# Altium schematic sheet WIFI_NVME.SchDoc
size C; SheetNumber: 7; SheetTotal: 24
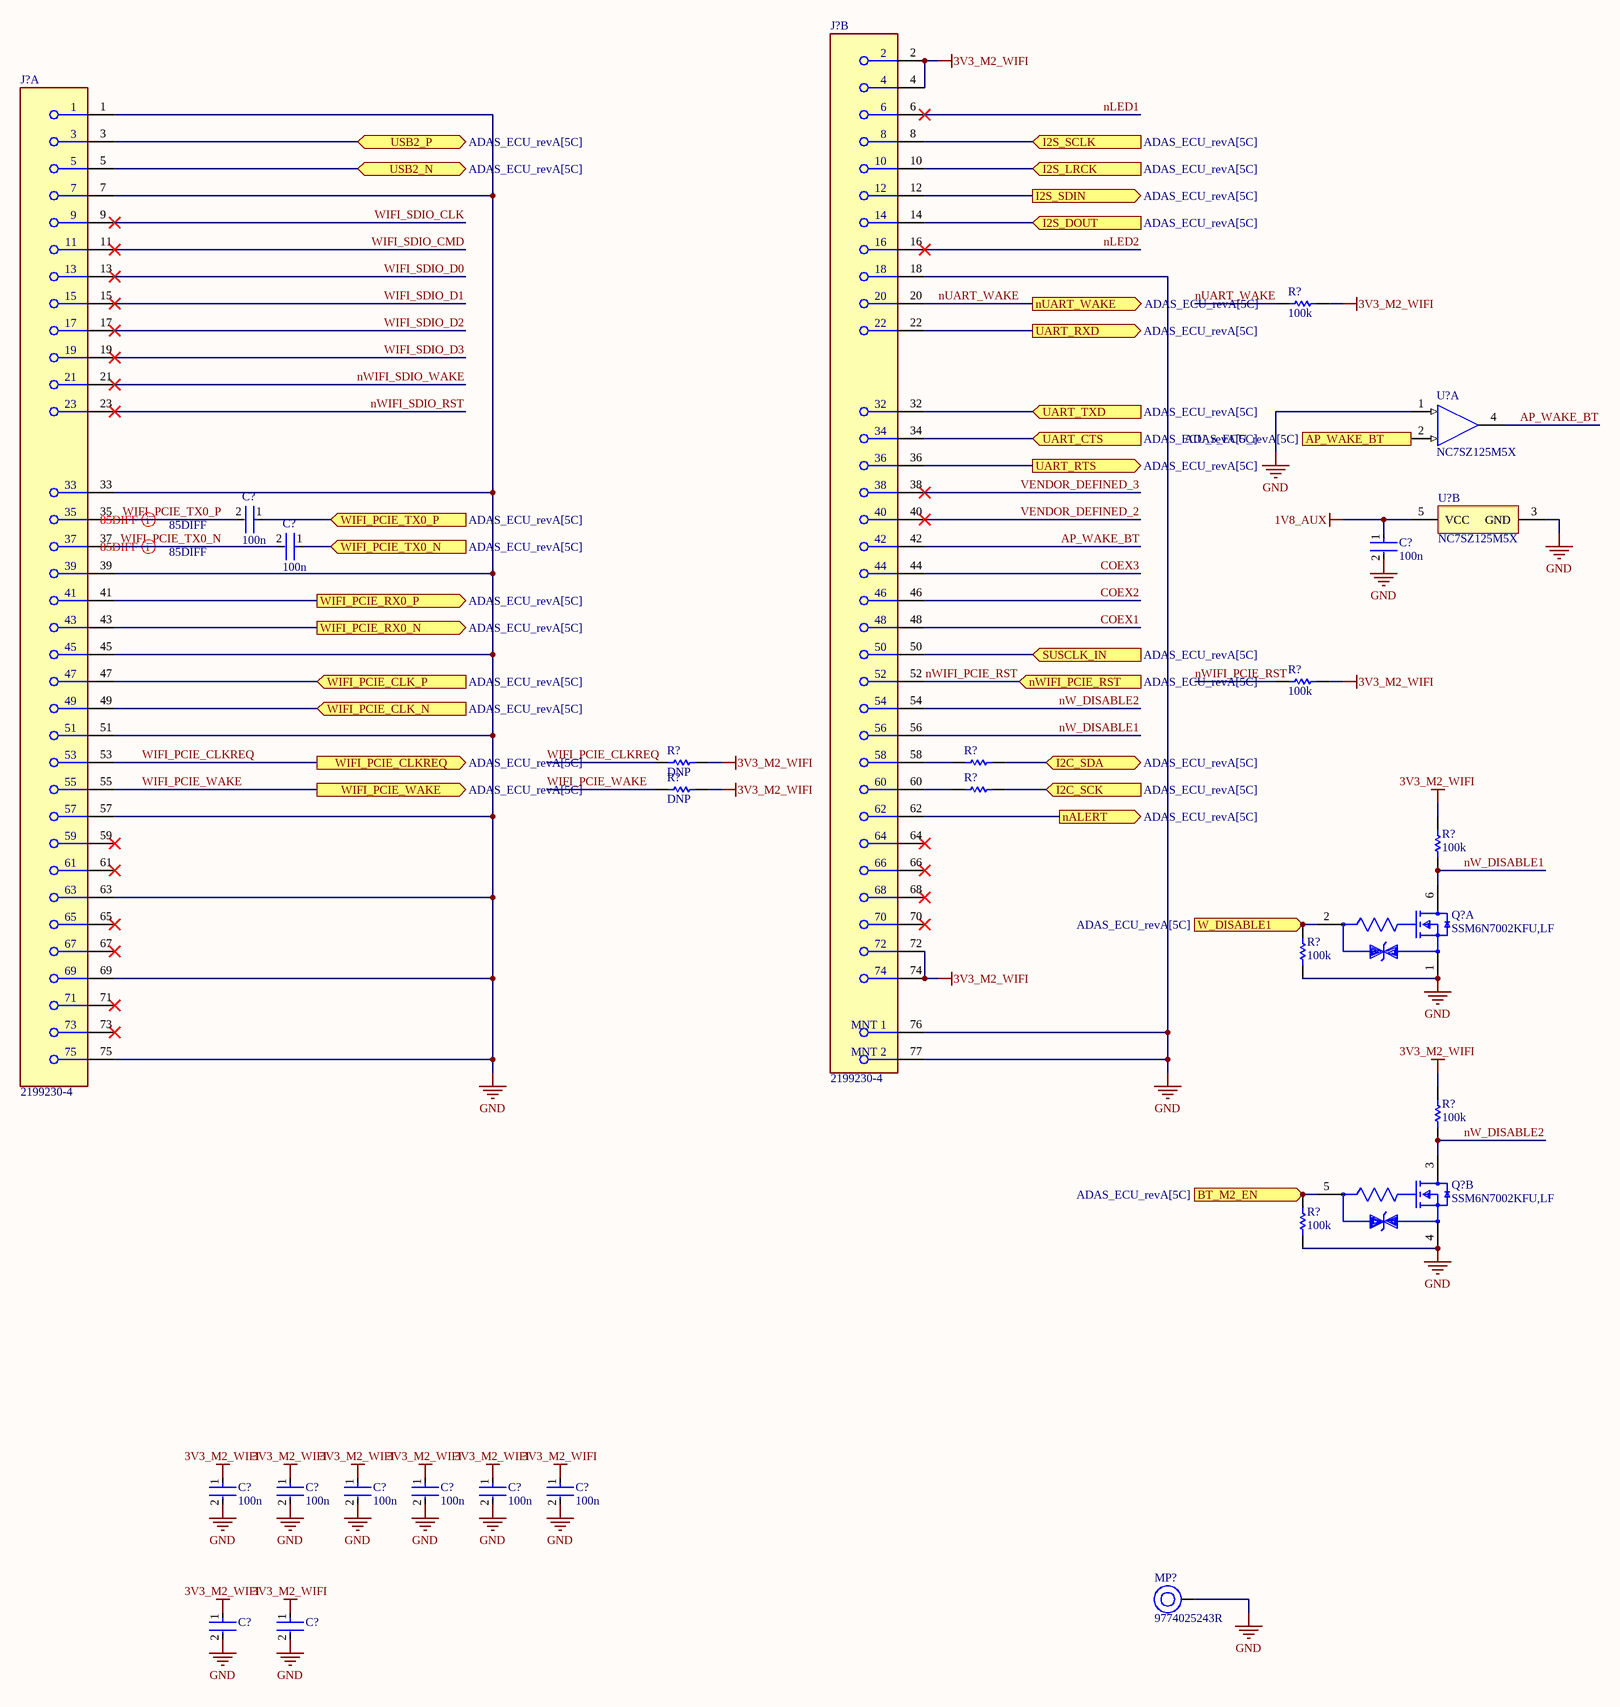
[diagram p0: WIFI_NVME.SchDoc]

## Parts
(Parts that share a designator on the sheet are numbered #1, #2 ... from top to bottom, then left to right.)
C?#1  100n  [FP-0402-L_1_0_0_05-W_0_5-IPC_A]
C?#2  100n  [FP-0402-L_1_0_0_05-W_0_5-IPC_A]
C?#3  100n  [FP-0402-L_1_0_0_05-W_0_5-IPC_A]
C?#4  100n  [FP-0402-L_1_0_0_05-W_0_5-IPC_A]
C?#5  100n  [FP-0402-L_1_0_0_05-W_0_5-IPC_A]
C?#6  100n  [FP-0402-L_1_0_0_05-W_0_5-IPC_A]
C?#7  100n  [FP-0402-L_1_0_0_05-W_0_5-IPC_A]
C?#8  100n  [FP-0402-L_1_0_0_05-W_0_5-IPC_A]
C?#9  100n  [FP-0402-L_1_0_0_05-W_0_5-IPC_A]
C?#10  GRM188R60J106ME47D  [FP-GRM188-0_1-e0_2_0_55-IPC_A]  (value not drawn)
C?#11  GRM188R60J106ME47D  [FP-GRM188-0_1-e0_2_0_55-IPC_A]  (value not drawn)
J?#1  2199230-4  [FP-2199230-4-MFG]  (part B of 2)
J?#2  2199230-4  [FP-2199230-4-MFG]  (part A of 2)
MP?  9774025243R  [9774025243]
Q?#1  SSM6N7002KFU,LF  [FP-SSOP6-P-0_65A-MFG]  (part A of 2)
Q?#2  SSM6N7002KFU,LF  [FP-SSOP6-P-0_65A-MFG]  (part B of 2)
R?#1  100k  [R0603B]
R?#2  100k  [R0603B]
R?#3  DNP  [RESC1005X40X25ML05T05]  (value not drawn)
R?#4  DNP  [R0603B]
R?#5  DNP  [RESC1005X40X25ML05T05]  (value not drawn)
R?#6  DNP  [R0603B]
R?#7  100k  [R0603B]
R?#8  100k  [R0603B]
R?#9  100k  [R0603B]
R?#10  100k  [R0603B]
U?#1  NC7SZ125M5X  [FAIR-SOT23-5_V]  (part A of 2)
U?#2  NC7SZ125M5X  [FAIR-SOT23-5_V]  (part B of 2)

## Ports
AP_WAKE_BT (in, see ADAS_ECU_revA[5C]), BT_M2_EN (in, see ADAS_ECU_revA[5C]), I2C_SCK (in, see ADAS_ECU_revA[5C]), I2C_SDA (bidir, see ADAS_ECU_revA[5C]), I2S_DOUT (in, see ADAS_ECU_revA[5C]), I2S_LRCK (in, see ADAS_ECU_revA[5C]), I2S_SCLK (in, see ADAS_ECU_revA[5C]), I2S_SDIN (out, see ADAS_ECU_revA[5C]), nALERT (out, see ADAS_ECU_revA[5C]), nUART_WAKE (out, see ADAS_ECU_revA[5C]), nWIFI_PCIE_RST (in, see ADAS_ECU_revA[5C]), SUSCLK_IN (in, see ADAS_ECU_revA[5C]), UART_CTS (in, see ADAS_ECU_revA[5C]), UART_RTS (out, see ADAS_ECU_revA[5C]), UART_RXD (out, see ADAS_ECU_revA[5C]), UART_TXD (in, see ADAS_ECU_revA[5C]), USB2_N (bidir, see ADAS_ECU_revA[5C]), USB2_P (bidir, see ADAS_ECU_revA[5C]), W_DISABLE1 (in, see ADAS_ECU_revA[5C]), WIFI_PCIE_CLK_N (in, see ADAS_ECU_revA[5C]), WIFI_PCIE_CLK_P (in, see ADAS_ECU_revA[5C]), WIFI_PCIE_CLKREQ (out, see ADAS_ECU_revA[5C]), WIFI_PCIE_RX0_N (out, see ADAS_ECU_revA[5C]), WIFI_PCIE_RX0_P (out, see ADAS_ECU_revA[5C]), WIFI_PCIE_TX0_N (in, see ADAS_ECU_revA[5C]), WIFI_PCIE_TX0_P (in, see ADAS_ECU_revA[5C]), WIFI_PCIE_WAKE (out, see ADAS_ECU_revA[5C])

## Nets
1V8_AUX: C?#2.1 U?#2.5(VCC)
3V3_M2_WIFI: C?#4.1 C?#5.1 C?#6.1 C?#7.1 C?#8.1 C?#9.1 C?#10.1 C?#11.1 J?#1.2 J?#1.4 J?#1.72 J?#1.74 R?#1.2 R?#2.2 R?#4.2 R?#6.2 R?#7.2 R?#9.2
GND: C?#2.2 C?#4.2 C?#5.2 C?#6.2 C?#7.2 C?#8.2 C?#9.2 C?#10.2 C?#11.2 J?#1.18 J?#1.76(MNT_1) J?#1.77(MNT_2) J?#2.1 J?#2.7 J?#2.33 J?#2.39 J?#2.45 J?#2.51 J?#2.57 J?#2.63 J?#2.69 J?#2.75 MP?.1 Q?#1.1(Source1) Q?#2.4(Source2) R?#8.1 R?#10.1 U?#1.1(~{OE}) U?#2.3(GND)
AP_WAKE_BT: J?#1.42 U?#1.4(Y)
AP_WAKE_BT: U?#1.2(A) ; port AP_WAKE_BT  [a separate net that carries the same name]
BT_M2_EN: Q?#2.5(Gate2) R?#10.2 ; port BT_M2_EN
COEX1: J?#1.48
COEX2: J?#1.46
COEX3: J?#1.44
I2C_SCK: R?#5.2 ; port I2C_SCK
I2C_SDA: R?#3.2 ; port I2C_SDA
I2S_DOUT: J?#1.14 ; port I2S_DOUT
I2S_LRCK: J?#1.10 ; port I2S_LRCK
I2S_SCLK: J?#1.8 ; port I2S_SCLK
I2S_SDIN: J?#1.12 ; port I2S_SDIN
nALERT: J?#1.62 ; port nALERT
nLED1: J?#1.6
nLED2: J?#1.16
nUART_WAKE: J?#1.20 R?#1.1 ; port nUART_WAKE
nW_DISABLE1: J?#1.56 Q?#1.6(Drain1) R?#7.1
nW_DISABLE2: J?#1.54 Q?#2.3(Drain2) R?#9.1
nWIFI_PCIE_RST: J?#1.52 R?#2.1 ; port nWIFI_PCIE_RST
nWIFI_SDIO_RST: J?#2.23
nWIFI_SDIO_WAKE: J?#2.21
SUSCLK_IN: J?#1.50 ; port SUSCLK_IN
UART_CTS: J?#1.34 ; port UART_CTS
UART_RTS: J?#1.36 ; port UART_RTS
UART_RXD: J?#1.22 ; port UART_RXD
UART_TXD: J?#1.32 ; port UART_TXD
USB2_N: J?#2.5 ; port USB2_N
USB2_P: J?#2.3 ; port USB2_P
VENDOR_DEFINED_2: J?#1.40
VENDOR_DEFINED_3: J?#1.38
W_DISABLE1: Q?#1.2(Gate1) R?#8.2 ; port W_DISABLE1
WIFI_PCIE_CLK_N: J?#2.49 ; port WIFI_PCIE_CLK_N
WIFI_PCIE_CLK_P: J?#2.47 ; port WIFI_PCIE_CLK_P
WIFI_PCIE_CLKREQ: J?#2.53 R?#4.1 ; port WIFI_PCIE_CLKREQ
WIFI_PCIE_RX0_N: J?#2.43 ; port WIFI_PCIE_RX0_N
WIFI_PCIE_RX0_P: J?#2.41 ; port WIFI_PCIE_RX0_P
WIFI_PCIE_TX0_N: C?#3.2 J?#2.37
WIFI_PCIE_TX0_N: C?#3.1 ; port WIFI_PCIE_TX0_N  [a separate net that carries the same name]
WIFI_PCIE_TX0_P: C?#1.2 J?#2.35
WIFI_PCIE_TX0_P: C?#1.1 ; port WIFI_PCIE_TX0_P  [a separate net that carries the same name]
WIFI_PCIE_WAKE: J?#2.55 R?#6.1 ; port WIFI_PCIE_WAKE
WIFI_SDIO_CLK: J?#2.9
WIFI_SDIO_CMD: J?#2.11
WIFI_SDIO_D0: J?#2.13
WIFI_SDIO_D1: J?#2.15
WIFI_SDIO_D2: J?#2.17
WIFI_SDIO_D3: J?#2.19
NetJ?#1_58: J?#1.58 R?#3.1
NetJ?#1_60: J?#1.60 R?#5.1

Not connected (* = marked no-connect by the designer): J?#1 64* 66* 68* 70*; J?#2 59* 61* 65* 67* 71* 73*

## Layout directives
differential pair; differential pair class 85DIFF: WIFI_PCIE_TX0_N, WIFI_PCIE_TX0_P

## Library data of the parts
C?#1-C?#9 = CMP-001-00058-1: LARGE PADS, 0402 CAP, CHANGE COMMENT TO MATCH REAL P/N; Capacitor Type: Ceramic; Min Operating Temperature: -55°C; Mounting Technology: Surface Mount; Pins: 2; Case/Package: 0402; RoHS Compliant: Yes; Max Operating Temperature: 85°C
C?#10 C?#11 = CMP-2006-02792-2: Chip Multilayer Ceramic Capacitors for General Purpose, 0603, 10uF, X5R, 15%, 20%, 6.3V; Packaging: Tape and Reel; Voltage Rating (DC): 6.3V; Width: 0.031inch; Termination: SMD/SMT; Dielectric: X5R; Package Quantity: 4000; Voltage Rating: 6.3V; Capacitance: 10uF; Case/Package: 0603; Min Operating Temperature: -55°C; Voltage: 6.3V; Length: 1.6mm; Thickness: 0.035inch; Lead Free: Lead Free; Depth: 0.8mm; Case Code (Imperial): 0603; Max Operating Temperature: 85°C; Material: Ceramic; Height: 0.8mm; Tolerance: 20%; Mount: Surface Mount; REACH SVHC: No SVHC; Radiation Hardening: No; Case Code (Metric): 1608
J?#1 J?#2 = CMP-03365-000002-1: CONN FEMALE 67POS 0.020 GOLD; Manufacturer: TE Connectivity; Conn Orientation: Right Angle; Pitch: 0.5mm; Number Of Contacts: 67; Voltage Rating: 50V; Is Female: yes; Current Rating: 0.5A; Lead Free: Yes; Temperature Range Low: -40°C; Device Class L3: unset; Package: 0; Manufacturer Part Number: 2199230-4; RoHS: TRUE; Digikey Description: CONN FEMALE 67POS 0.020 GOLD; Category: Conn; Device Class L1: Connectors; Temperature Range High: +80°C; ComponentLink2Description: Datasheet; ComponentLink2URL: https://www.te.com/commerce/DocumentDelivery/DDEController?Action=showdoc&DocId=Customer+Drawing%7F2199230%7FB3%7Fpdf%7FEnglish%7FENG_CD_2199230_B3.pdf%7F2199230-4; Mouser Description: PCI Express / PCI Connectors .5PITCH 4.2H KEY E EMBOSS NGFF MINICARD; Automotive: No; Conn Gender: Female; Height: 4.2mm; Device Class L2: Card Edge Connectors; Contact Material: Gold,Nickel; Number Of Rows: 2; Octopart: https://octopart.com/2199230-4-te+connectivity-46436156; Temperature: -40°C to +80°C
MP? = CMP-03913-59774857-1: 9774025243R Spacer Material: Steel, Tin-Plated Mounting: SMT Series: WA-SMST Thread D: M2; Outside Diameter: 4.3434mm; Threaded/Unthreaded: Threaded; Plating: Tin; REACH SVHC: Unknown; NexarPartId: 59774857; RoHS: Compliant; Material: Steel; Packaging: Tape and Reel; Max Operating Temperature: 150°C; Min Operating Temperature: -55°C; Length: 2.5mm; Height: 2.5mm
Q?#1 Q?#2 = CMP-35916-000009-1: MOSFET 2N-CH 60V 0.3A; Input Capacitance: 40pF; Continuous Drain Current (ID): 300mA; Max Power Dissipation: 285mW; FET Type: 2 N-Channel; Rds On Max: 1.5R; Mount: Surface Mount; Drain to Source Voltage (Vdss): 60V; Packaging: Tape and Reel
R?#1 R?#2 R?#4 R?#6-R?#10 = CMP-009-00002-14: Resistor
R?#3 R?#5 = CMP-009-00118-2: READ THE NAME; Pins: 2; Component Type: Standard; Design Item ID: CMP-009-00206-2; Source: 0402jump.SchLib
U?#1 U?#2 = CMP-2000-06816-1: TinyLogic UHS Buffer with Three-State Output, 1.65 to 5.5 V, -40 to 85 degC, 5-Pin SOT23, RoHS, Tape and Reel; Manufacturer: Fairchild Semiconductor; Input Signal Type: Single-Ended; Maximum Operating Supply Voltage: 5.5V; Number of Outputs per Chip: 1; Maximum Propagation Delay Time @ Maximum CL: 5.7@3.3V; Minimum Operating Supply Voltage: 1.65V; Maximum Quiescent Current: 2uA; Propagation Delay Test Condition: 50pF; Lead Finish: MatteTin; Number of Output Enables per Chip: 1Low; Maximum Low Level Output Current: 32mA; Output Type: 3-State; Package Version: 08/2015; Max Processing Temp: 260; Maximum High Level Output Current: -32mA; Tolerant I/Os: 5V; Bus Hold: No; Fabrication Technology: CMOS; Polarity: Non-Inverting; Typical Operating Supply Voltage: 1.8; Logic Function: Buffer/LineDriver; Manufacturer URL: https://www.fairchildsemi.com/; Mounting: SurfaceMount; Number of Channels per Chip: 1; Package Description: 5-Pin Small Outline Transistor, Body 2.9 x 1.6 mm, Pitch 0.95 mm; Package Reference: SOT23-5; Number of Elements per Chip: 1; Package URL: https://www.fairchildsemi.com/package-drawings/MA/MA05B.pdf; Datasheet URL: https://www.fairchildsemi.com/datasheets/NC/NC7SZ125.pdf; Datasheet Version: Rev. 1.0.5, 01/2014; Mounting Technology: SurfaceMount; Operating Temperature: -40to85C; Number of Inputs per Chip: 1